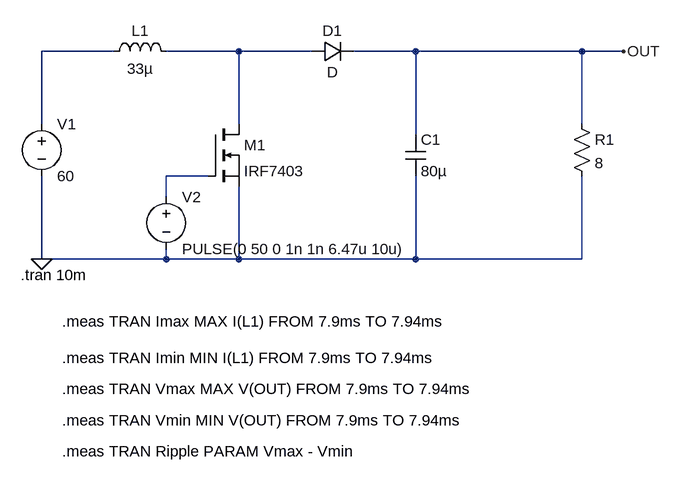
[diagram p0: schematic boost_test.asc]
boost_test.asc, the LTspice schematic file:
Version 4.1
SHEET 1 880 728
WIRE -16 96 -128 96
WIRE 176 96 64 96
WIRE 288 96 176 96
WIRE 448 96 352 96
WIRE 704 96 448 96
WIRE 768 96 704 96
WIRE -128 208 -128 96
WIRE 176 208 176 96
WIRE 704 208 704 96
WIRE 448 224 448 96
WIRE 128 288 64 288
WIRE 64 320 64 288
WIRE -128 416 -128 288
WIRE 64 416 64 400
WIRE 64 416 -128 416
WIRE 176 416 176 304
WIRE 176 416 64 416
WIRE 448 416 448 288
WIRE 448 416 176 416
WIRE 704 416 704 288
WIRE 704 416 448 416
FLAG 768 96 OUT
FLAG -128 416 0
SYMBOL voltage -128 192 R0
SYMATTR InstName V1
SYMATTR Value 60
SYMBOL nmos 128 208 R0
SYMATTR InstName M1
SYMATTR Value IRF7403
SYMBOL diode 288 112 R270
WINDOW 0 32 32 VTop 2
WINDOW 3 0 32 VBottom 2
SYMATTR InstName D1
SYMBOL cap 432 224 R0
SYMATTR InstName C1
SYMATTR Value 80µ
SYMBOL res 688 192 R0
SYMATTR InstName R1
SYMATTR Value 8
SYMBOL voltage 64 304 R0
WINDOW 123 0 0 Left 0
WINDOW 39 0 0 Left 0
SYMATTR InstName V2
SYMATTR Value PULSE(0 50 0 1n 1n 6.47u 10u)
SYMBOL ind -32 112 R270
WINDOW 0 32 56 VTop 2
WINDOW 3 5 56 VBottom 2
SYMATTR InstName L1
SYMATTR Value 33µ
SYMATTR SpiceLine Rser=0.05
TEXT -160 440 Left 2 !.tran 10m
TEXT -96 512 Left 2 !.meas TRAN Imax MAX I(L1) FROM 7.9ms TO 7.94ms
TEXT -96 568 Left 2 !.meas TRAN Imin MIN I(L1) FROM 7.9ms TO 7.94ms
TEXT -96 616 Left 2 !.meas TRAN Vmax MAX V(OUT) FROM 7.9ms TO 7.94ms
TEXT -96 664 Left 2 !.meas TRAN Vmin MIN V(OUT) FROM 7.9ms TO 7.94ms
TEXT -96 712 Left 2 !.meas TRAN Ripple PARAM Vmax - Vmin

The netlist it stands for:
* boost_test.asc
V1 N001 0 60
M1 N002 N003 0 0 IRF7403
D1 N002 OUT D
C1 OUT 0 80µ
R1 OUT 0 8
V2 N003 0 PULSE(0 50 0 1n 1n 6.47u 10u)
L1 N001 N002 33µ Rser=0.05
.model D D
.lib standard.dio
.model NMOS NMOS
.model PMOS PMOS
.lib standard.mos
.tran 10m
.meas TRAN Imax MAX I(L1) FROM 7.9ms TO 7.94ms
.meas TRAN Imin MIN I(L1) FROM 7.9ms TO 7.94ms
.meas TRAN Vmax MAX V(OUT) FROM 7.9ms TO 7.94ms
.meas TRAN Vmin MIN V(OUT) FROM 7.9ms TO 7.94ms
.meas TRAN Ripple PARAM Vmax - Vmin
.backanno
.end